# EAGLE schematic Middle Board - Power-DESKTOP-OKEVC1G (EAGLE 8.6.0)
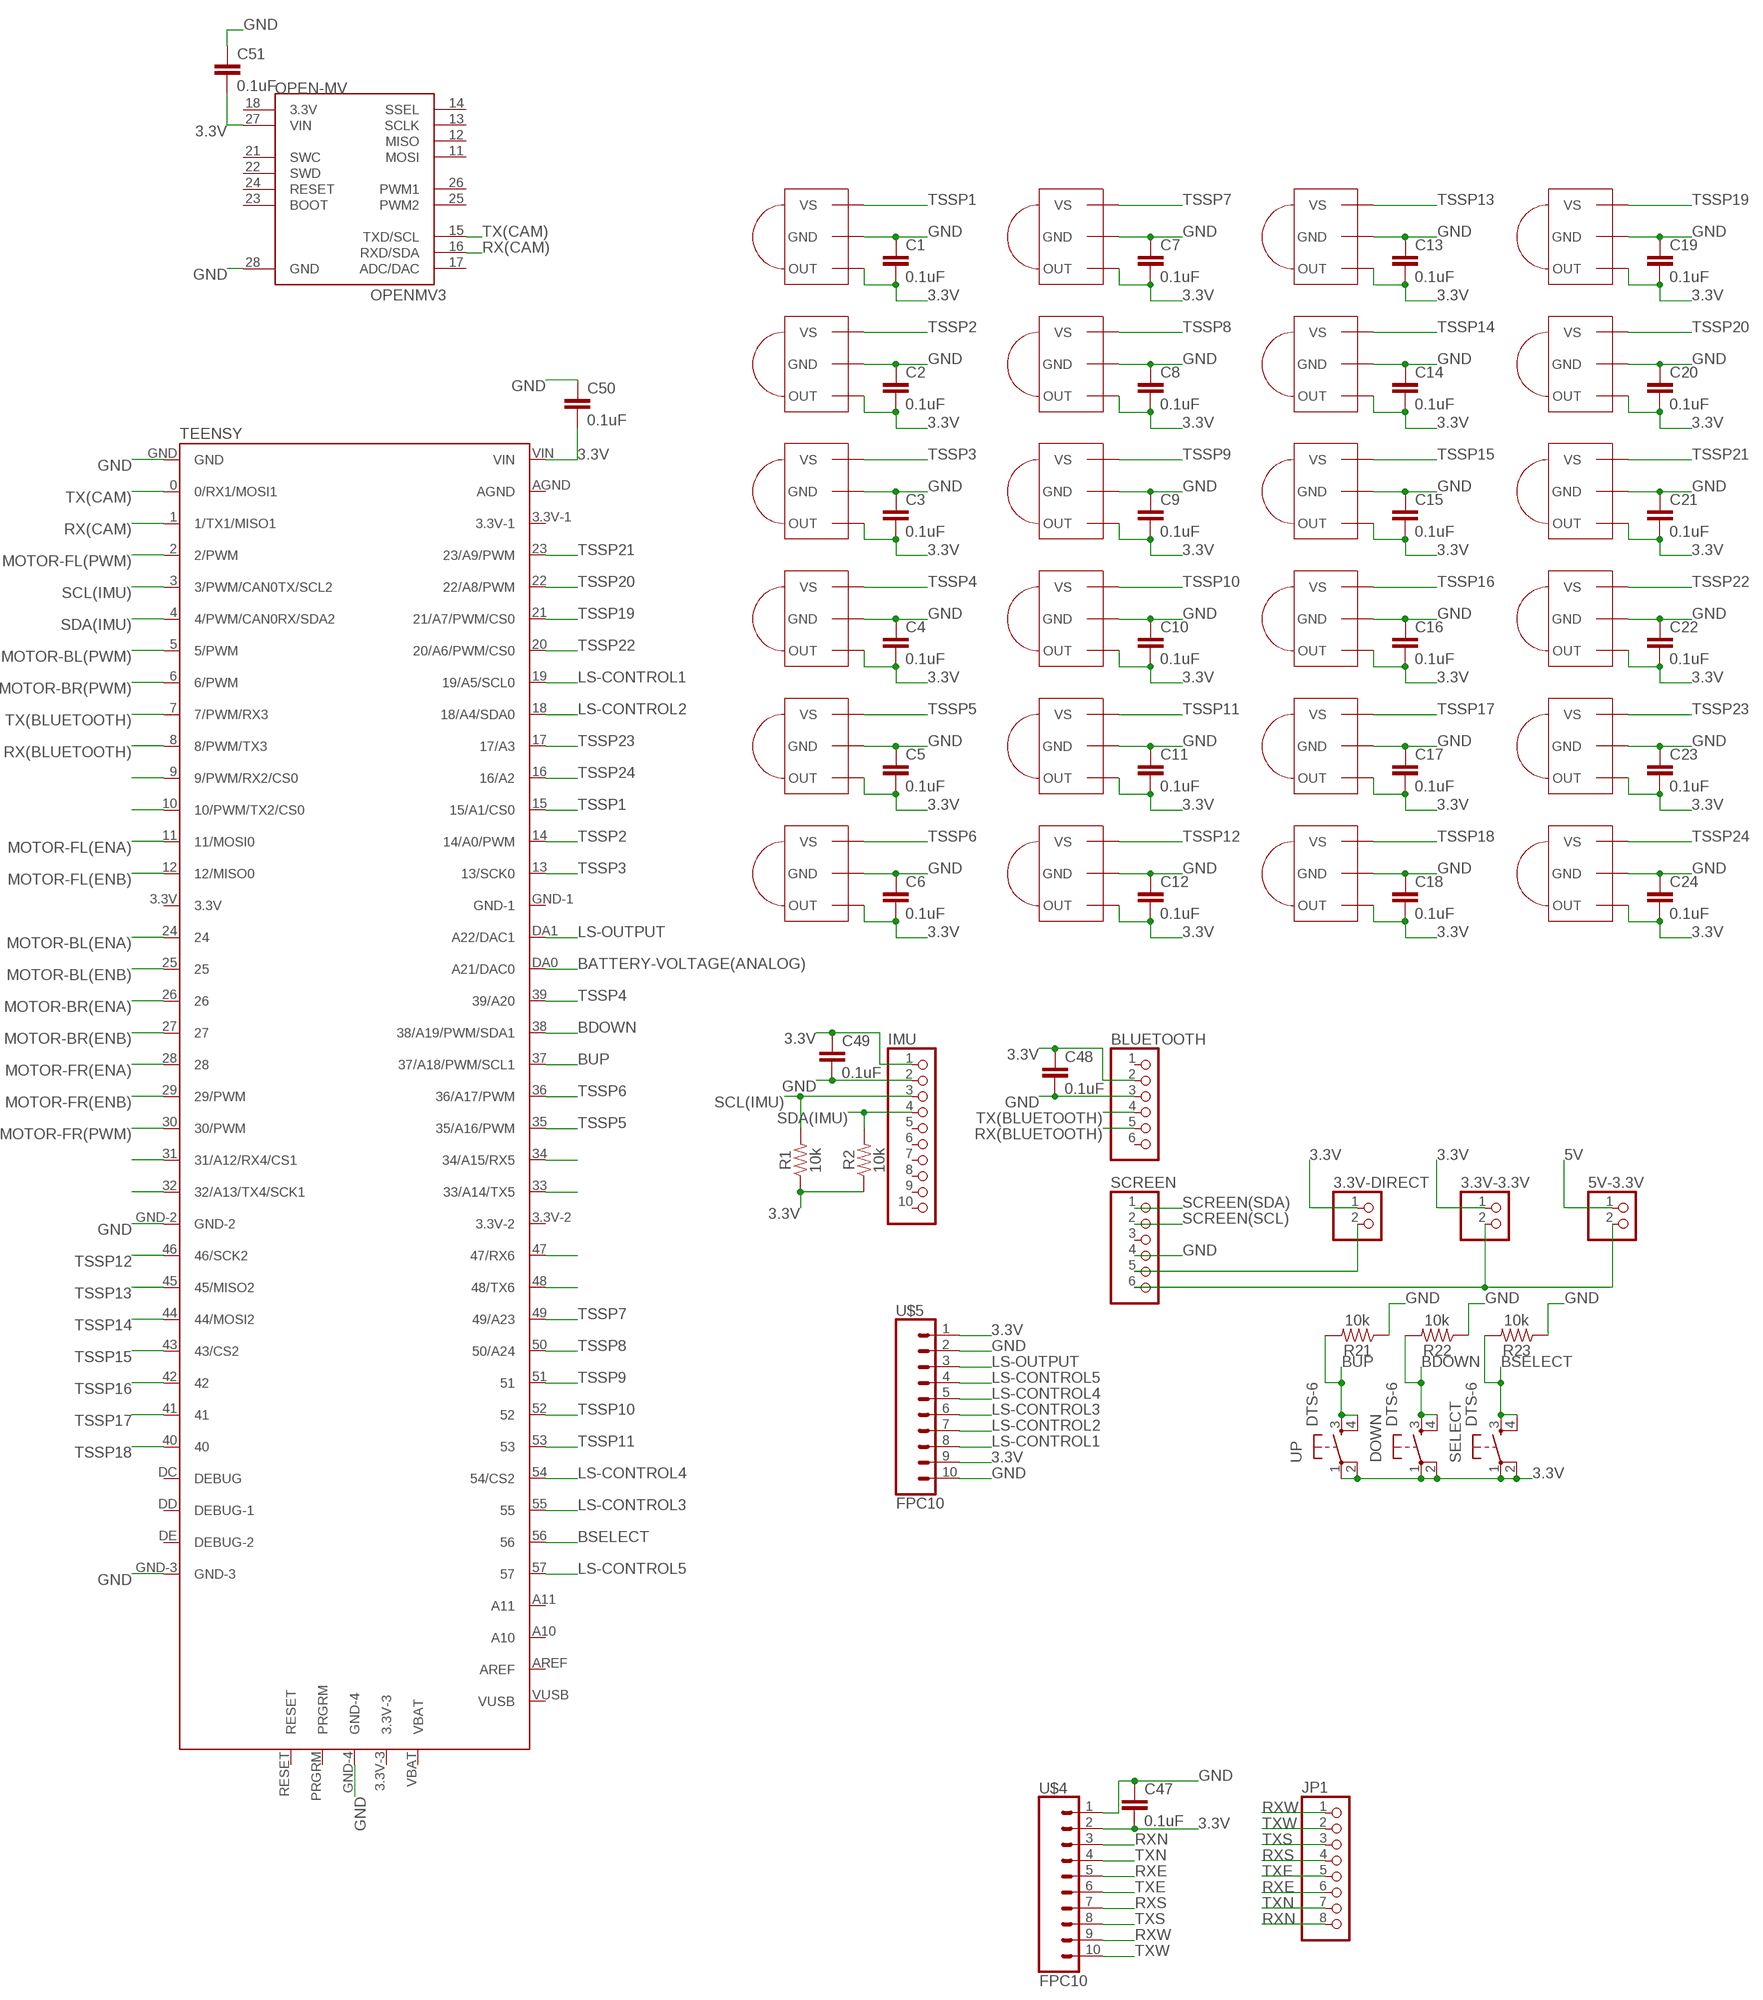
[diagram p0: schematic, sheet 1, part 1 of 2]
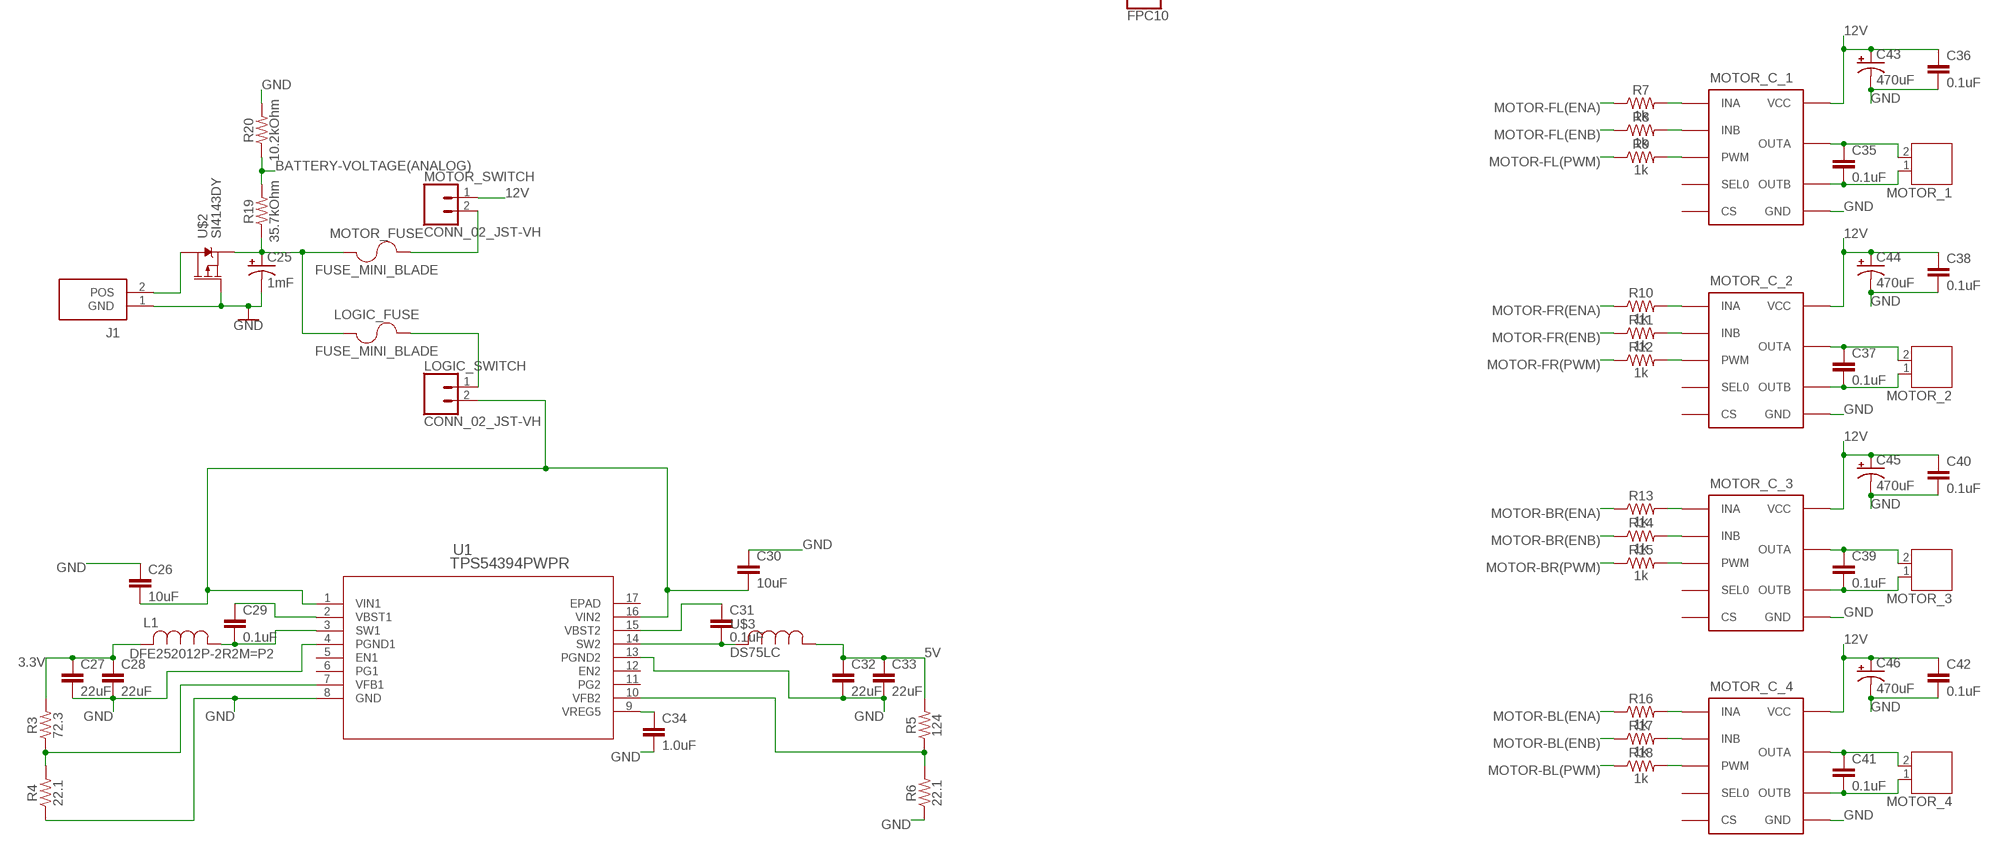
[diagram p1: schematic, sheet 1, part 2 of 2]

## Parts
3.3V-3.3V  PINHD-1X2  [1X02]
3.3V-DIRECT  PINHD-1X2  [1X02]
5V-3.3V  PINHD-1X2  [1X02]
BLUETOOTH  PINHD-1X6  [1X06]
C1  0.1uF  0.1UF-0603-25V-(+80/-20%)  [0603]
C2  0.1uF  0.1UF-0603-25V-(+80/-20%)  [0603]
C3  0.1uF  0.1UF-0603-25V-(+80/-20%)  [0603]
C4  0.1uF  0.1UF-0603-25V-(+80/-20%)  [0603]
C5  0.1uF  0.1UF-0603-25V-(+80/-20%)  [0603]
C6  0.1uF  0.1UF-0603-25V-(+80/-20%)  [0603]
C7  0.1uF  0.1UF-0603-25V-(+80/-20%)  [0603]
C8  0.1uF  0.1UF-0603-25V-(+80/-20%)  [0603]
C9  0.1uF  0.1UF-0603-25V-(+80/-20%)  [0603]
C10  0.1uF  0.1UF-0603-25V-(+80/-20%)  [0603]
C11  0.1uF  0.1UF-0603-25V-(+80/-20%)  [0603]
C12  0.1uF  0.1UF-0603-25V-(+80/-20%)  [0603]
C13  0.1uF  0.1UF-0603-25V-(+80/-20%)  [0603]
C14  0.1uF  0.1UF-0603-25V-(+80/-20%)  [0603]
C15  0.1uF  0.1UF-0603-25V-(+80/-20%)  [0603]
C16  0.1uF  0.1UF-0603-25V-(+80/-20%)  [0603]
C17  0.1uF  0.1UF-0603-25V-(+80/-20%)  [0603]
C18  0.1uF  0.1UF-0603-25V-(+80/-20%)  [0603]
C19  0.1uF  0.1UF-0603-25V-(+80/-20%)  [0603]
C20  0.1uF  0.1UF-0603-25V-(+80/-20%)  [0603]
C21  0.1uF  0.1UF-0603-25V-(+80/-20%)  [0603]
C22  0.1uF  0.1UF-0603-25V-(+80/-20%)  [0603]
C23  0.1uF  0.1UF-0603-25V-(+80/-20%)  [0603]
C24  0.1uF  0.1UF-0603-25V-(+80/-20%)  [0603]
C25  1mF  1000UF-RADIAL-5MM-25V-20%  [CPOL-RADIAL-5MM-10MM]
C26  10uF  10UF-0805-10V-10%  [0805]
C27  22uF  22UF-0805-6.3V-20%  [0805]
C28  22uF  22UF-0805-6.3V-20%  [0805]
C29  0.1uF  0.1UF-0603-25V-5%  [0603]
C30  10uF  10UF-0805-10V-10%  [0805]
C31  0.1uF  0.1UF-0603-25V-5%  [0603]
C32  22uF  22UF-0805-6.3V-20%  [0805]
C33  22uF  22UF-0805-6.3V-20%  [0805]
C34  1.0uF  1.0UF-0805-25V-10%  [0805]
C35  0.1uF  0.1UF-0603-25V-(+80/-20%)  [0603]
C36  0.1uF  0.1UF-0603-25V-(+80/-20%)  [0603]
C37  0.1uF  0.1UF-0603-25V-(+80/-20%)  [0603]
C38  0.1uF  0.1UF-0603-25V-(+80/-20%)  [0603]
C39  0.1uF  0.1UF-0603-25V-(+80/-20%)  [0603]
C40  0.1uF  0.1UF-0603-25V-(+80/-20%)  [0603]
C41  0.1uF  0.1UF-0603-25V-(+80/-20%)  [0603]
C42  0.1uF  0.1UF-0603-25V-(+80/-20%)  [0603]
C43  470uF  CPOL-USE3.5-8  [E3,5-8]
C44  470uF  CPOL-USE3.5-8  [E3,5-8]
C45  470uF  CPOL-USE3.5-8  [E3,5-8]
C46  470uF  CPOL-USE3.5-8  [E3,5-8]
C47  0.1uF  0.1UF-0603-25V-(+80/-20%)  [0603]
C48  0.1uF  0.1UF-0603-25V-(+80/-20%)  [0603]
C49  0.1uF  0.1UF-0603-25V-(+80/-20%)  [0603]
C50  0.1uF  0.1UF-0603-25V-(+80/-20%)  [0603]
C51  0.1uF  0.1UF-0603-25V-(+80/-20%)  [0603]
DOWN  DTS-6  [DTS-6]
IMU  PINHD-1X10  [1X10]
J1  PRT-10474  [SHDR2W320P716_1X2_1574X813X158]
JP1  PINHD-1X8  [1X08]
L1  DFE252012P-2R2M=P2  [DFE252012P-1R0M=P2]
LOGIC_FUSE  FUSE_MINI_BLADE  [SL-1538]
LOGIC_SWITCH  CONN_02_JST-VH  [B2P-VH]
MOTOR_1  JST-PH2  [JST-PH2]
MOTOR_2  JST-PH2  [JST-PH2]
MOTOR_3  JST-PH2  [JST-PH2]
MOTOR_4  JST-PH2  [JST-PH2]
MOTOR_C_1  VNH7100BASTR  [SO-16]
MOTOR_C_2  VNH7100BASTR  [SO-16]
MOTOR_C_3  VNH7100BASTR  [SO-16]
MOTOR_C_4  VNH7100BASTR  [SO-16]
MOTOR_FUSE  FUSE_MINI_BLADE  [SL-1538]
MOTOR_SWITCH  CONN_02_JST-VH  [B2P-VH]
OPEN-MV  OPENMV3  [OPENMV3]
R1  10k  10KOHM-0603-1/10W-1%  [0603]
R2  10k  10KOHM-0603-1/10W-1%  [0603]
R3  72.3  75KOHM-0603-1/10W-1%  [0603]
R4  22.1  75KOHM-0603-1/10W-1%  [0603]
R5  124  75KOHM-0603-1/10W-1%  [0603]
R6  22.1  75KOHM-0603-1/10W-1%  [0603]
R7  1k  1KOHM-0603-1/10W-1%  [0603]
R8  1k  1KOHM-0603-1/10W-1%  [0603]
R9  1k  1KOHM-0603-1/10W-1%  [0603]
R10  1k  1KOHM-0603-1/10W-1%  [0603]
R11  1k  1KOHM-0603-1/10W-1%  [0603]
R12  1k  1KOHM-0603-1/10W-1%  [0603]
R13  1k  1KOHM-0603-1/10W-1%  [0603]
R14  1k  1KOHM-0603-1/10W-1%  [0603]
R15  1k  1KOHM-0603-1/10W-1%  [0603]
R16  1k  1KOHM-0603-1/10W-1%  [0603]
R17  1k  1KOHM-0603-1/10W-1%  [0603]
R18  1k  1KOHM-0603-1/10W-1%  [0603]
R19  35.7kOhm  75KOHM-0603-1/10W-1%  [0603]
R20  10.2kOhm  75KOHM-0603-1/10W-1%  [0603]
R21  10k  10KOHM-0603-1/10W-1%  [0603]
R22  10k  10KOHM-0603-1/10W-1%  [0603]
R23  10k  10KOHM-0603-1/10W-1%  [0603]
SCREEN  PINHD-1X6  [1X06]
SELECT  DTS-6  [DTS-6]
TEENSY  TEENSY-3.5  [TEENSY-3.5]
TSSP1  TSSP58038  [MINICAST]
TSSP2  TSSP58038  [MINICAST]
TSSP3  TSSP58038  [MINICAST]
TSSP4  TSSP58038  [MINICAST]
TSSP5  TSSP58038  [MINICAST]
TSSP6  TSSP58038  [MINICAST]
TSSP7  TSSP58038  [MINICAST]
TSSP8  TSSP58038  [MINICAST]
TSSP9  TSSP58038  [MINICAST]
TSSP10  TSSP58038  [MINICAST]
TSSP11  TSSP58038  [MINICAST]
TSSP12  TSSP58038  [MINICAST]
TSSP13  TSSP58038  [MINICAST]
TSSP14  TSSP58038  [MINICAST]
TSSP15  TSSP58038  [MINICAST]
TSSP16  TSSP58038  [MINICAST]
TSSP17  TSSP58038  [MINICAST]
TSSP18  TSSP58038  [MINICAST]
TSSP19  TSSP58038  [MINICAST]
TSSP20  TSSP58038  [MINICAST]
TSSP21  TSSP58038  [MINICAST]
TSSP22  TSSP58038  [MINICAST]
TSSP23  TSSP58038  [MINICAST]
TSSP24  TSSP58038  [MINICAST]
U1  TPS54394PWPR  [PWP16_3P4X2P46]
U$2  SI4143DY  [SO-8]
U$3  DS75LC  [DS75LC]
U$4  FPC10  [FPC10]
U$5  FPC10  [FPC10]
UP  DTS-6  [DTS-6]

## Nets
3.3V: 3.3V-3.3V.1 3.3V-DIRECT.1 BLUETOOTH.2 C1.2 C2.2 C3.2 C4.2 C5.2 C6.2 C7.2 C8.2 C9.2 C10.2 C11.2 C12.2 C13.2 C14.2 C15.2 C16.2 C17.2 C18.2 C19.2 C20.2 C21.2 C22.2 C23.2 C24.2 C27.1 C28.1 C47.2 C48.1 C49.1 C50.2 C51.2 DOWN.1 DOWN.2 IMU.1 L1.2 OPEN-MV.27(VIN) R1.1 R2.1 R3.2 SELECT.1 SELECT.2 TEENSY.VIN TSSP1.1(OUT) TSSP2.1(OUT) TSSP3.1(OUT) TSSP4.1(OUT) TSSP5.1(OUT) TSSP6.1(OUT) TSSP7.1(OUT) TSSP8.1(OUT) TSSP9.1(OUT) TSSP10.1(OUT) TSSP11.1(OUT) TSSP12.1(OUT) TSSP13.1(OUT) TSSP14.1(OUT) TSSP15.1(OUT) TSSP16.1(OUT) TSSP17.1(OUT) TSSP18.1(OUT) TSSP19.1(OUT) TSSP20.1(OUT) TSSP21.1(OUT) TSSP22.1(OUT) TSSP23.1(OUT) TSSP24.1(OUT) U$4.2 U$5.1 U$5.9 UP.1 UP.2
5V: 5V-3.3V.1 C32.1 C33.1 R5.2 U$3.P$1
12V: C36.1 C38.1 C40.1 C42.1 C43.+ C44.+ C45.+ C46.+ MOTOR_C_1.4(VCC) MOTOR_C_1.5(VCC) MOTOR_C_1.12(VCC) MOTOR_C_2.4(VCC) MOTOR_C_2.5(VCC) MOTOR_C_2.12(VCC) MOTOR_C_3.4(VCC) MOTOR_C_3.5(VCC) MOTOR_C_3.12(VCC) MOTOR_C_4.4(VCC) MOTOR_C_4.5(VCC) MOTOR_C_4.12(VCC) MOTOR_SWITCH.1
BATTERY-VOLTAGE(ANALOG): R19.2 R20.1 TEENSY.DA0(A21/DAC0)
BDOWN: DOWN.3 DOWN.4 R22.2 TEENSY.38(38/A19/PWM/SDA1)
BSELECT: R23.2 SELECT.3 SELECT.4 TEENSY.56
BUP: R21.2 TEENSY.37(37/A18/PWM/SCL1) UP.3 UP.4
GND: BLUETOOTH.3 C1.1 C2.1 C3.1 C4.1 C5.1 C6.1 C7.1 C8.1 C9.1 C10.1 C11.1 C12.1 C13.1 C14.1 C15.1 C16.1 C17.1 C18.1 C19.1 C20.1 C21.1 C22.1 C23.1 C24.1 C25.- C26.1 C27.2 C28.2 C30.1 C32.2 C33.2 C34.2 C36.2 C38.2 C40.2 C42.2 C43.- C44.- C45.- C46.- C47.1 C48.2 C49.2 C50.1 C51.1 IMU.2 J1.1(GND) MOTOR_C_1.1(GND) MOTOR_C_1.8(GND) MOTOR_C_1.9(GND) MOTOR_C_1.16(GND) MOTOR_C_2.1(GND) MOTOR_C_2.8(GND) MOTOR_C_2.9(GND) MOTOR_C_2.16(GND) MOTOR_C_3.1(GND) MOTOR_C_3.8(GND) MOTOR_C_3.9(GND) MOTOR_C_3.16(GND) MOTOR_C_4.1(GND) MOTOR_C_4.8(GND) MOTOR_C_4.9(GND) MOTOR_C_4.16(GND) OPEN-MV.28(GND) R4.1 R6.1 R20.2 R21.1 R22.1 R23.1 SCREEN.4 TEENSY.GND TEENSY.GND-2 TEENSY.GND-3 TEENSY.GND-4 TSSP1.2(GND) TSSP2.2(GND) TSSP3.2(GND) TSSP4.2(GND) TSSP5.2(GND) TSSP6.2(GND) TSSP7.2(GND) TSSP8.2(GND) TSSP9.2(GND) TSSP10.2(GND) TSSP11.2(GND) TSSP12.2(GND) TSSP13.2(GND) TSSP14.2(GND) TSSP15.2(GND) TSSP16.2(GND) TSSP17.2(GND) TSSP18.2(GND) TSSP19.2(GND) TSSP20.2(GND) TSSP21.2(GND) TSSP22.2(GND) TSSP23.2(GND) TSSP24.2(GND) U1.4(PGND1) U1.8(GND) U1.13(PGND2) U$2.4(G) U$4.1 U$5.2 U$5.10
LS-CONTROL1: TEENSY.19(19/A5/SCL0) U$5.8
LS-CONTROL2: TEENSY.18(18/A4/SDA0) U$5.7
LS-CONTROL3: TEENSY.55 U$5.6
LS-CONTROL4: TEENSY.54(54/CS2) U$5.5
LS-CONTROL5: TEENSY.57 U$5.4
LS-OUTPUT: TEENSY.DA1(A22/DAC1) U$5.3
MOTOR-BL(ENA): R16.1 TEENSY.24
MOTOR-BL(ENB): R17.1 TEENSY.25
MOTOR-BL(PWM): R18.1 TEENSY.5(5/PWM)
MOTOR-BR(ENA): R13.1 TEENSY.26
MOTOR-BR(ENB): R14.1 TEENSY.27
MOTOR-BR(PWM): R15.1 TEENSY.6(6/PWM)
MOTOR-FL(ENA): R7.1 TEENSY.11(11/MOSI0)
MOTOR-FL(ENB): R8.1 TEENSY.12(12/MISO0)
MOTOR-FL(PWM): R9.1 TEENSY.2(2/PWM)
MOTOR-FR(ENA): R10.1 TEENSY.28
MOTOR-FR(ENB): R11.1 TEENSY.29(29/PWM)
MOTOR-FR(PWM): R12.1 TEENSY.30(30/PWM)
N$1: J1.2(POS) U$2.5(D) U$2.6(D) U$2.7(D) U$2.8(D)
N$2: MOTOR_FUSE.P$2 MOTOR_SWITCH.2
N$3: C25.+ LOGIC_FUSE.P$1 MOTOR_FUSE.P$1 R19.1 U$2.1(S) U$2.2(S) U$2.3(S)
N$4: LOGIC_FUSE.P$2 LOGIC_SWITCH.1
N$5: MOTOR_C_1.3(INA) R7.2
N$6: C29.1 U1.2(VBST1)
N$7: C29.2 L1.1 U1.3(SW1)
N$8: C31.1 U1.15(VBST2)
N$9: R3.1 R4.2 U1.7(VFB1)
N$10: C31.2 U1.14(SW2) U$3.P$2
N$11: C34.1 U1.9(VREG5)
N$12: MOTOR_C_1.6(INB) R8.2
N$13: C26.2 C30.2 LOGIC_SWITCH.2 U1.1(VIN1) U1.16(VIN2)
N$14: R5.1 R6.2 U1.10(VFB2)
N$15: MOTOR_C_1.11(PWM) R9.2
N$16: C35.1 MOTOR_1.2 MOTOR_C_1.2(OUTA) MOTOR_C_1.15(OUTA)
N$17: C35.2 MOTOR_1.1 MOTOR_C_1.7(OUTB) MOTOR_C_1.10(OUTB)
N$18: MOTOR_C_2.3(INA) R10.2
N$19: MOTOR_C_2.6(INB) R11.2
N$20: MOTOR_C_2.11(PWM) R12.2
N$21: C37.1 MOTOR_2.2 MOTOR_C_2.2(OUTA) MOTOR_C_2.15(OUTA)
N$22: C37.2 MOTOR_2.1 MOTOR_C_2.7(OUTB) MOTOR_C_2.10(OUTB)
N$23: MOTOR_C_3.3(INA) R13.2
N$24: MOTOR_C_3.6(INB) R14.2
N$25: MOTOR_C_3.11(PWM) R15.2
N$26: C39.1 MOTOR_3.2 MOTOR_C_3.2(OUTA) MOTOR_C_3.15(OUTA)
N$27: C39.2 MOTOR_3.1 MOTOR_C_3.7(OUTB) MOTOR_C_3.10(OUTB)
N$28: MOTOR_C_4.3(INA) R16.2
N$29: MOTOR_C_4.6(INB) R17.2
N$30: MOTOR_C_4.11(PWM) R18.2
N$31: C41.1 MOTOR_4.2 MOTOR_C_4.2(OUTA) MOTOR_C_4.15(OUTA)
N$32: C41.2 MOTOR_4.1 MOTOR_C_4.7(OUTB) MOTOR_C_4.10(OUTB)
N$33: TEENSY.47(47/RX6)
N$34: TEENSY.31(31/A12/RX4/CS1)
N$35: 3.3V-DIRECT.2 SCREEN.5
N$36: TEENSY.32(32/A13/TX4/SCK1)
N$37: 3.3V-3.3V.2 5V-3.3V.2 SCREEN.6
N$38: TEENSY.9(9/PWM/RX2/CS0)
N$39: TEENSY.10(10/PWM/TX2/CS0)
N$46: TEENSY.48(48/TX6)
RX(BLUETOOTH): BLUETOOTH.5 TEENSY.8(8/PWM/TX3)
RX(CAM): OPEN-MV.16(RXD/SDA) TEENSY.1(1/TX1/MISO1)
RXE: JP1.6 U$4.5
RXN: JP1.8 U$4.3
RXS: JP1.4 U$4.7
RXW: JP1.1 U$4.9
SCL(IMU): IMU.3 R1.2 TEENSY.3(3/PWM/CAN0TX/SCL2)
SCREEN(SCL): SCREEN.2
SCREEN(SDA): SCREEN.1
SDA(IMU): IMU.4 R2.2 TEENSY.4(4/PWM/CAN0RX/SDA2)
TSSP1: TEENSY.15(15/A1/CS0) TSSP1.3(VS)
TSSP2: TEENSY.14(14/A0/PWM) TSSP2.3(VS)
TSSP3: TEENSY.13(13/SCK0) TSSP3.3(VS)
TSSP4: TEENSY.39(39/A20) TSSP4.3(VS)
TSSP5: TEENSY.35(35/A16/PWM) TSSP5.3(VS)
TSSP6: TEENSY.36(36/A17/PWM) TSSP6.3(VS)
TSSP7: TEENSY.49(49/A23) TSSP7.3(VS)
TSSP8: TEENSY.50(50/A24) TSSP8.3(VS)
TSSP9: TEENSY.51 TSSP9.3(VS)
TSSP10: TEENSY.52 TSSP10.3(VS)
TSSP11: TEENSY.53 TSSP11.3(VS)
TSSP12: TEENSY.46(46/SCK2) TSSP12.3(VS)
TSSP13: TEENSY.45(45/MISO2) TSSP13.3(VS)
TSSP14: TEENSY.44(44/MOSI2) TSSP14.3(VS)
TSSP15: TEENSY.43(43/CS2) TSSP15.3(VS)
TSSP16: TEENSY.42 TSSP16.3(VS)
TSSP17: TEENSY.41 TSSP17.3(VS)
TSSP18: TEENSY.40 TSSP18.3(VS)
TSSP19: TEENSY.21(21/A7/PWM/CS0) TSSP19.3(VS)
TSSP20: TEENSY.22(22/A8/PWM) TSSP20.3(VS)
TSSP21: TEENSY.23(23/A9/PWM) TSSP21.3(VS)
TSSP22: TEENSY.20(20/A6/PWM/CS0) TSSP22.3(VS)
TSSP23: TEENSY.17(17/A3) TSSP23.3(VS)
TSSP24: TEENSY.16(16/A2) TSSP24.3(VS)
TX(BLUETOOTH): BLUETOOTH.4 TEENSY.7(7/PWM/RX3)
TX(CAM): OPEN-MV.15(TXD/SCL) TEENSY.0(0/RX1/MOSI1)
TXE: JP1.5 U$4.6
TXN: JP1.7 U$4.4
TXS: JP1.3 U$4.8
TXW: JP1.2 U$4.10
UU: TEENSY.34(34/A15/RX5)
UU2: TEENSY.33(33/A14/TX5)
Unconnected: BLUETOOTH.1 BLUETOOTH.6 IMU.5 IMU.6 IMU.7 IMU.8 IMU.9 IMU.10 MOTOR_C_1.13(CS) MOTOR_C_1.14(SEL0) MOTOR_C_2.13(CS) MOTOR_C_2.14(SEL0) MOTOR_C_3.13(CS) MOTOR_C_3.14(SEL0) MOTOR_C_4.13(CS) MOTOR_C_4.14(SEL0) OPEN-MV.11(MOSI) OPEN-MV.12(MISO) OPEN-MV.13(SCLK) OPEN-MV.14(SSEL) OPEN-MV.17(ADC/DAC) OPEN-MV.18(3.3V) OPEN-MV.21(SWC) OPEN-MV.22(SWD) OPEN-MV.23(BOOT) OPEN-MV.24(RESET) OPEN-MV.25(PWM2) OPEN-MV.26(PWM1) SCREEN.3 TEENSY.3.3V TEENSY.3.3V-1 TEENSY.3.3V-2 TEENSY.3.3V-3 TEENSY.A10 TEENSY.A11 TEENSY.AGND TEENSY.AREF TEENSY.DC(DEBUG) TEENSY.DD(DEBUG-1) TEENSY.DE(DEBUG-2) TEENSY.GND-1 TEENSY.PRGRM TEENSY.RESET TEENSY.VBAT TEENSY.VUSB U1.5(EN1) U1.6(PG1) U1.11(PG2) U1.12(EN2) U1.17(EPAD)

## Library data of the parts
3.3V-3.3V 3.3V-DIRECT 5V-3.3V = PinHead+:PINHD-1X2: PIN HEADER
BLUETOOTH SCREEN = PinHead+:PINHD-1X6: PIN HEADER
C1-C24 C35-C42 C47-C51 = SparkFun-Capacitors:0.1UF: 0.1µF ceramic capacitors A capacitor is a passive two-terminal electrical component used to store electrical energy temporarily in an electric field.; PROD_ID: CAP-00810
C25 = SparkFun-Capacitors:1000UF: 1,000µF/1mF ceramic capacitors A capacitor is a passive two-terminal electrical component used to store electrical energy temporarily in an electric field. CAP-08070; PROD_ID: CAP-09538
C26 C30 = SparkFun-Capacitors:10UF: 10.0µF ceramic capacitors A capacitor is a passive two-terminal electrical component used to store electrical energy temporarily in an electric field.; PROD_ID: CAP-11330
C27 C28 C32 C33 = SparkFun-Capacitors:22UF: 22µF ceramic capacitors A capacitor is a passive two-terminal electrical component used to store electrical energy temporarily in an electric field.; PROD_ID: CAP-08402
C29 C31 = SparkFun-Capacitors:0.1UF: 0.1µF ceramic capacitors A capacitor is a passive two-terminal electrical component used to store electrical energy temporarily in an electric field.; PROD_ID: CAP-08604
C34 = SparkFun-Capacitors:1.0UF: 1µF ceramic capacitors A capacitor is a passive two-terminal electrical component used to store electrical energy temporarily in an electric field.; PROD_ID: CAP-08064
C43-C46 = adafruit:CPOL-US: POLARIZED CAPACITOR, American symbol
DOWN SELECT UP = switch-tact:DTS-6
IMU = PinHead+:PINHD-1X10: PIN HEADER
J1 = XT60:PRT-10474: Soldering Workstation Equipment XT60 Connectors Male/Female Pair Source: Datasheet <http://cdn.sparkfun.com/datasheets/Prototyping/xt60.pdf>; ARROW_PART_NUMBER: PRT-10474; DESCRIPTION: Soldering Workstation Equipment XT60 Connectors Male/Female Pair; HEIGHT: 15.875mm; MANUFACTURER_NAME: SparkFun; MANUFACTURER_PART_NUMBER: PRT-10474
JP1 = PinHead+:PINHD-1X8: PIN HEADER
L1 = Inductor:DFE252012P-2R2M=P2; MANUFACTURER_PART_NUMBER: DFE252012P2R2M=P2; VENDOR: Murata
LOGIC_FUSE MOTOR_FUSE = Fuse_Holder:FUSE_MINI_BLADE: SL-1538 Aliexpress <https://www.aliexpress.com/item/SL-1538-MINI-Style-Blade-Fuse-Holers-PCB-Mount-Fuse-holders-0153008/503553051.html>
LOGIC_SWITCH MOTOR_SWITCH = JST-VH:CONN_02_JST-VH: B2P-VH(LF)(SN) Digikey <https://www.digikey.com.au/product-detail/en/jst-sales-america-inc/B2P-VH-LF-SN/455-1639-ND/926547>
MOTOR_1-MOTOR_4 = jst-ph:JST-PH2
MOTOR_C_1-MOTOR_C_4 = VNH7100BASTR:VNH7100BASTR: VNH7100BASTR
OPEN-MV = OpenMV:OPENMV3
R1 R2 R21-R23 = SparkFun-Resistors:10KOHM: 10kΩ resistor A resistor is a passive two-terminal electrical component that implements electrical resistance as a circuit element. Resistors act to reduce current flow, and, at the same time, act to lower voltage levels within circuits. - Wikipedia; PROD_ID: RES-00824
R3-R6 R19 R20 = SparkFun-Resistors:75KOHM: 75Ω resistor A resistor is a passive two-terminal electrical component that implements electrical resistance as a circuit element. Resistors act to reduce current flow, and, at the same time, act to lower voltage levels within circuits. - Wikipedia; PROD_ID: RES-09737; VALUE: 75
R7-R18 = SparkFun-Resistors:1KOHM: 1kΩ resistor A resistor is a passive two-terminal electrical component that implements electrical resistance as a circuit element. Resistors act to reduce current flow, and, at the same time, act to lower voltage levels within circuits. - Wikipedia; PROD_ID: RES-07856
TEENSY = teensy-3.5:TEENSY-3.5
TSSP1-TSSP24 = IR Receivers:TSSP58038: IR Receiver Module for Light Barrier Systems datasheet <http://www.vishay.com/docs/82479/tssp58038.pdf>
U1 = TPS54394PWP:TPS54394PWPR; MANUFACTURER_PART_NUMBER: TPS54394PWPR; VENDOR: Texas Instruments
U$2 = MOSFET:SI4143DY: MOSFET P-CHANNEL 30V 25.3A 8SO Digikey <https://www.digikey.com.au/product-detail/en/vishay-siliconix/SI4143DY-T1-GE3/SI4143DY-T1-GE3CT-ND/6834487>
U$3 = Inductor:DS75LC
U$4 U$5 = FFC:FPC10